# EAGLE schematic NFC-Attendance-System (EAGLE 9.5.2)
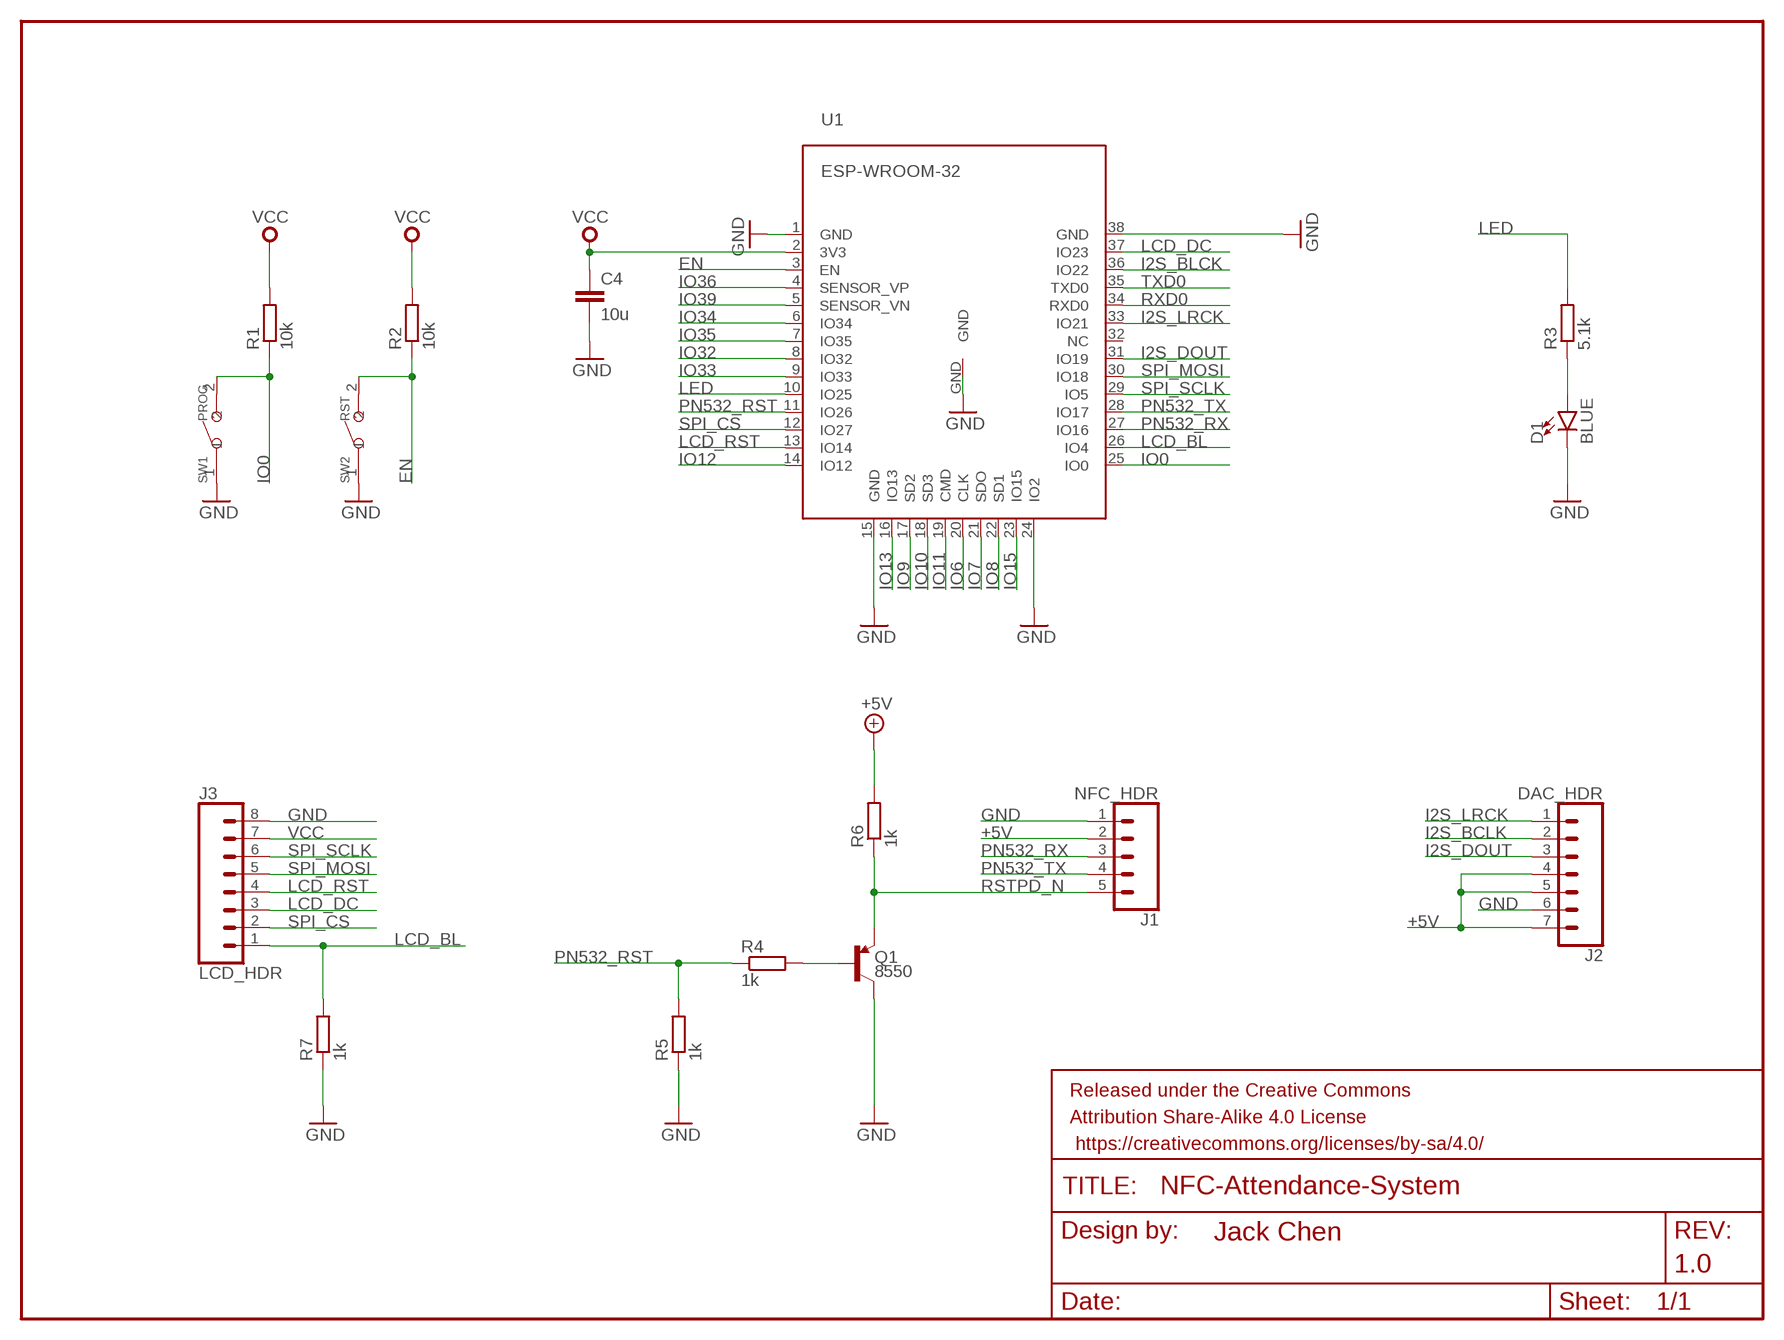
[diagram p0: schematic, sheet 1]

## Parts
C4  10u  C-EUC0603  [C0603]
D1  BLUE  LED5MM  [LED_5MM]
FRAME1  FRAME-LETTER  [CREATIVE_COMMONS]
J1  NFC_HDR  CONN_05  [1X05]
J2  DAC_HDR  CONN_07  [1X07]
J3  LCD_HDR  CONN_08"  [1X08]
Q1  8550  TRANS_PNP-MMBT4403  [SOT23-3]
R1  10k  R-EU_R0603  [R0603]
R2  10k  R-EU_R0603  [R0603]
R3  5.1k  R-EU_R0603  [R0603]
R4  1k  R-EU_R0603  [R0603]
R5  1k  R-EU_R0603  [R0603]
R6  1k  R-EU_R0603  [R0603]
R7  1k  R-EU_R0603  [R0603]
SW1  PROG  SMD-BUTTON(2P-6.0X3.0X2.5MM)-DHT-1163S  [SW2-4.0-6.0X3.0X2.5MM]
SW2  RST  SMD-BUTTON(2P-6.0X3.0X2.5MM)-DHT-1163S  [SW2-4.0-6.0X3.0X2.5MM]
U1  ESP-WROOM-32  [ESP-WROOM-32]

## Nets
+5V: J1.2 J2.4 J2.5 J2.7 R6.2
EN: R2.1 SW2.2 U1.3(EN)
GND [gnd]: C4.2 D1.K(C) J1.1 J2.6 J3.8 Q1.3(C) R5.1 R7.1 SW1.1 SW2.1 U1.1(GND) U1.15(GND) U1.24(IO2) U1.38(GND) U1.GND
I2S_BCLK: J2.2
I2S_BLCK: U1.36(IO22)
I2S_DOUT: J2.3 U1.31(IO19)
I2S_LRCK: J2.1 U1.33(IO21)
IO0: R1.1 SW1.2 U1.25(IO0)
IO6: U1.20(CLK)
IO7: U1.21(SDO)
IO8: U1.22(SD1)
IO9: U1.17(SD2)
IO10: U1.18(SD3)
IO11: U1.19(CMD)
IO12: U1.14(IO12)
IO13: U1.16(IO13)
IO15: U1.23(IO15)
IO32: U1.8(IO32)
IO33: U1.9(IO33)
IO34: U1.6(IO34)
IO35: U1.7(IO35)
IO36: U1.4(SENSOR_VP)
IO39: U1.5(SENSOR_VN)
LCD_BL: J3.1 R7.2 U1.26(IO4)
LCD_DC: J3.3 U1.37(IO23)
LCD_RST: J3.4 U1.13(IO14)
LED: R3.2 U1.10(IO25)
N$1: D1.A R3.1
N$2: Q1.1(B) R4.2
PN532_RST: R4.1 R5.2 U1.11(IO26)
PN532_RX: J1.3 U1.27(IO16)
PN532_TX: J1.4 U1.28(IO17)
RSTPD_N: J1.5 Q1.2(E) R6.1
RXD0: U1.34(RXD0)
SPI_CS: J3.2 U1.12(IO27)
SPI_MOSI: J3.5 U1.30(IO18)
SPI_SCLK: J3.6 U1.29(IO5)
TXD0: U1.35(TXD0)
VCC [vcc]: C4.1 J3.7 R1.2 R2.2 U1.2(3V3)
Unconnected: U1.32(NC)

## Library data of the parts
C4 = rcl:C-EU: CAPACITOR, European symbol; SPICEPREFIX: C
D1 = SparkFun-LED:LED: LED (Generic) Standard schematic elements and footprints for 5mm, 3mm, 1206, and 0603 sized LEDs. Generic LEDs with no color specified.
FRAME1 = SparkFun-Aesthetics:FRAME-LETTER: Schematic Frame - Letter Standard 8.5x11 US Letter frame; DESIGNER: Jack Chen; REV: 1.0
J1 = SparkFun-Connectors:CONN_05: Multi connection point. Often used as Generic Header-pin footprint for 0.1 inch spaced/style header connections On any of the 0.1 inch spaced packages, you can populate with these: Break Away Headers - Straight <https://www.sparkfun.com/products/116> (PRT-00116) Break Away Male Headers - Right Angle <https://www.sparkfun.com/products/553> (PRT-00553) Female Headers <https://www.sparkfun.com/products/115> (PRT-00115) Break Away Headers - Machine Pin <https://www.sparkfun.com/products/117> (PRT-00117) Break Away Female Headers - Swiss Machine Pin <https://www.sparkfun.com/products/743> (PRT-00743) For SCREWTERMINALS and SPRING TERMINALS visit here: Screw Terimnals on SparkFun.com <https://www.sparkfun.com/search/results?term=Screw+Terminals> (5mm/3.5mm/2.54mm spacing) This device is also useful as a general connection point to wire up your design to another part of your project. Our various solder wires solder well into these plated through hole pads. Hook-Up Wire - Assortment (Stranded, 22 AWG) <https://www.sparkfun.com/products/11375> (PRT-11375) Hook-Up Wire - Assortment (Solid Core, 22 AWG) <https://www.sparkfun.com/products/11367> (PRT-11367) View the entire wire category on our website here <https://www.sparkfun.com/categories/141> Special notes: Molex polarized connector foot print use with SKU : PRT-08231 with associated crimp pins and housings. 1MM SMD Version SKU: PRT-10208
J2 = SparkFun-Connectors:CONN_07: Multi connection point. Often used as Generic Header-pin footprint for 0.1 inch spaced/style header connections On any of the 0.1 inch spaced packages, you can populate with these: Break Away Headers - Straight <https://www.sparkfun.com/products/116> (PRT-00116) Break Away Male Headers - Right Angle <https://www.sparkfun.com/products/553> (PRT-00553) Female Headers <https://www.sparkfun.com/products/115> (PRT-00115) Break Away Headers - Machine Pin <https://www.sparkfun.com/products/117> (PRT-00117) Break Away Female Headers - Swiss Machine Pin <https://www.sparkfun.com/products/743> (PRT-00743) For SCREWTERMINALS and SPRING TERMINALS visit here: Screw Terimnals on SparkFun.com <https://www.sparkfun.com/search/results?term=Screw+Terminals> (5mm/3.5mm/2.54mm spacing) This device is also useful as a general connection point to wire up your design to another part of your project. Our various solder wires solder well into these plated through hole pads. Hook-Up Wire - Assortment (Stranded, 22 AWG) <https://www.sparkfun.com/products/11375> (PRT-11375) Hook-Up Wire - Assortment (Solid Core, 22 AWG) <https://www.sparkfun.com/products/11367> (PRT-11367) View the entire wire category on our website here <https://www.sparkfun.com/categories/141> Special notes: Molex polarized connector foot print use with SKU : PRT-08231 with associated crimp pins and housings. 1MM SMD Version SKU: PRT-10208 NOTES ON THE VARIANTS LOCK and LOCK_LONGPADS... This footprint was designed to help hold the alignment of a through-hole component (i.e. 6-pin header) while soldering it into place. You may notice that each hole has been shifted either up or down by 0.005 of an inch from it's more standard position (which is a perfectly straight line). This slight alteration caused the pins (the squares in the middle) to touch the edges of the holes. Because they are alternating, it causes a "brace" to hold the component in place. 0.005 has proven to be the perfect amount of "off-center" position when using our standard breakaway headers. Although looks a little odd when you look at the bare footprint, once you have a header in there, the alteration is very hard to notice. Also,if you push a header all the way into place, it is covered up entirely on the bottom side.
J3 = SparkFun-Connectors:CONN_08: Multi connection point. Often used as Generic Header-pin footprint for 0.1 inch spaced/style header connections On any of the 0.1 inch spaced packages, you can populate with these: Break Away Headers - Straight <https://www.sparkfun.com/products/116> (PRT-00116) Break Away Male Headers - Right Angle <https://www.sparkfun.com/products/553> (PRT-00553) Female Headers <https://www.sparkfun.com/products/115> (PRT-00115) Break Away Headers - Machine Pin <https://www.sparkfun.com/products/117> (PRT-00117) Break Away Female Headers - Swiss Machine Pin <https://www.sparkfun.com/products/743> (PRT-00743) Arduino Stackable Header - 8 Pin <https://www.sparkfun.com/products/9279> (PRT-09279) For SCREWTERMINALS and SPRING TERMINALS visit here: Screw Terimnals on SparkFun.com <https://www.sparkfun.com/search/results?term=Screw+Terminals> (5mm/3.5mm/2.54mm spacing) This device is also useful as a general connection point to wire up your design to another part of your project. Our various solder wires solder well into these plated through hole pads. Hook-Up Wire - Assortment (Stranded, 22 AWG) <https://www.sparkfun.com/products/11375> (PRT-11375) Hook-Up Wire - Assortment (Solid Core, 22 AWG) <https://www.sparkfun.com/products/11367> (PRT-11367) View the entire wire category on our website here <https://www.sparkfun.com/categories/141> Special notes: Molex polarized connector foot print use with SKU : PRT-08231 with associated crimp pins and housings. 1MM SMD Version SKU: PRT-10208 NOTES ON THE VARIANTS LOCK and LOCK_LONGPADS... This footprint was designed to help hold the alignment of a through-hole component (i.e. 6-pin header) while soldering it into place. You may notice that each hole has been shifted either up or down by 0.005 of an inch from it's more standard position (which is a perfectly straight line). This slight alteration caused the pins (the squares in the middle) to touch the edges of the holes. Because they are alternating, it causes a "brace" to hold the component in place. 0.005 has proven to be the perfect amount of "off-center" position when using our standard breakaway headers. Although looks a little odd when you look at the bare footprint, once you have a header in there, the alteration is very hard to notice. Also,if you push a header all the way into place, it is covered up entirely on the bottom side.; PROD_ID: CONN-08438
Q1 = SparkFun-DiscreteSemi:TRANS_PNP: PNP transistor Current controlled devices typically used to amplify current or used as a switch. SparkFun Products: SparkFun Serial Enabled 16x2 LCD - Red on Black <https://www.sparkfun.com/products/9068> SparkFun Logomatic <https://www.sparkfun.com/products/12772>; PROD_ID: TRANS-09245; VALUE: 600mA/40V
R1-R7 = rcl:R-EU_: RESISTOR, European symbol; SPICEPREFIX: R
SW1 SW2 = Seeed-OPL-Switch:SMD-BUTTON(2P-6.0X3.0X2.5MM): 311020029
U1 = esp32:ESP-WROOM-32

## Net classes
0 default: width 0.254 mm, drill 0.305 mm, clearance 0.152 mm
1 gnd: width 0.635 mm, drill 0.635 mm, clearance 0.254 mm
2 vcc: width 0.406 mm, drill 0.406 mm, clearance 0.254 mm